# EAGLE design MHI-AC-Ctrl_v1.2 (EAGLE 9.6.2)
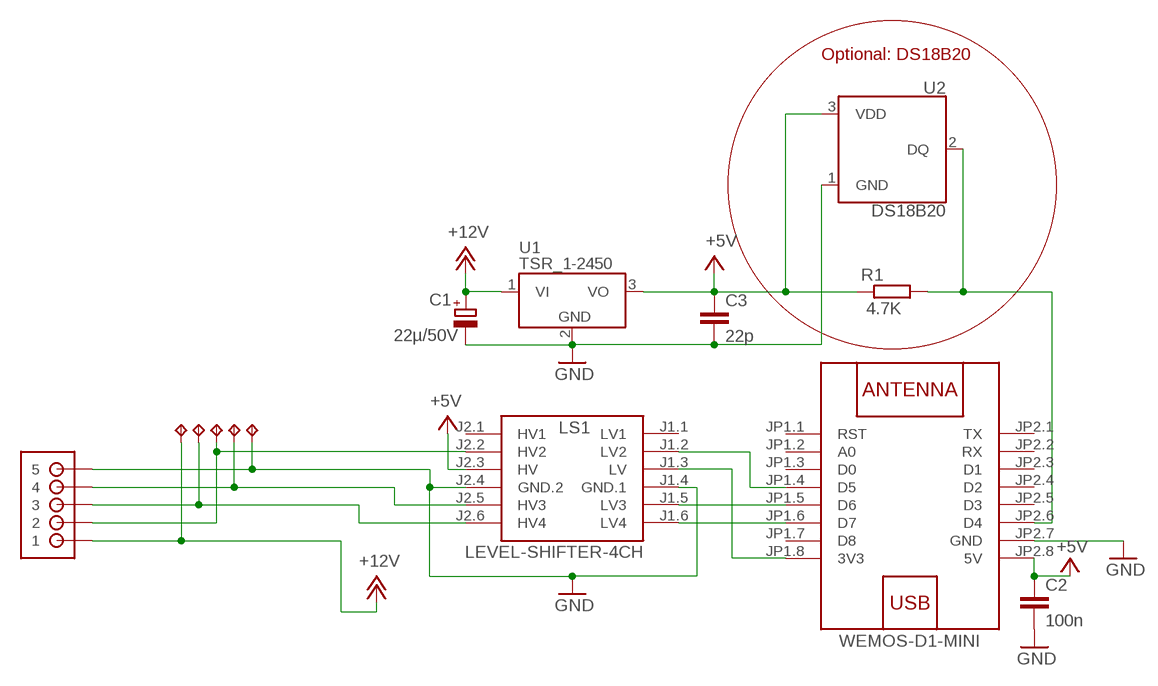
[diagram p0: schematic, sheet 1]

## Parts
C1  22µ/50V  CPOL-EUE5-10.5  [E5-10,5]
C2  100n  C-EU025-024X044  [C025-024X044]
C3  22p  C-EU025-024X044  [C025-024X044]
LS1  LEVEL-SHIFTER-4CH  [LEVEL-SHIFTER-4CH]
R1  4.7K  R-EU_0204/7  [0204/7]
TP9  TPPAD1-13  [P1-13]
TP10  TPPAD1-13  [P1-13]
TP11  TPPAD1-13  [P1-13]
TP12  TPPAD1-13  [P1-13]
TP13  TPPAD1-13  [P1-13]
U1  TSR_1-2450  TSR_1-24_  [TSR-1]
U2  DS18B20  [TO-92-TO92127P495H2044-3]
U$1  WEMOS-D1-MINI  [WEMOS-D1-MINI]
U$4  JST-PH_5-PIN_HEADER  [JST_B5B-PH_HEADER]

## Nets
+3V3: LS1.J1.3(LV) U$1.JP1.8(3V3)
+5V: C2.1 C3.1 LS1.J2.3(HV) R1.2 U1.3(VO) U2.3(VDD) U$1.JP2.8(5V)
+12V: C1.+ TP13.TP U1.1(VI) U$4.P1
GND: C1.- C2.2 C3.2 LS1.J1.4(GND.1) LS1.J2.4(GND.2) TP9.TP U1.2(GND) U2.1(GND) U$1.JP2.7(GND) U$4.P5
MISO: LS1.J2.5(HV3) TP10.TP U$4.P4
N$1: LS1.J1.5(LV3) U$1.JP1.5(D6)
N$2: LS1.J1.6(LV4) U$1.JP1.6(D7)
N$3: LS1.J2.2(HV2) TP11.TP U$4.P2
N$4: LS1.J2.6(HV4) TP12.TP U$4.P3
N$14: R1.1 U2.2(DQ) U$1.JP2.6(D4)
SCL_LV: LS1.J1.2(LV2) U$1.JP1.4(D5)
Unconnected: LS1.J1.1(LV1) LS1.J2.1(HV1) U$1.JP1.1(RST) U$1.JP1.2(A0) U$1.JP1.3(D0) U$1.JP1.7(D8) U$1.JP2.1(TX) U$1.JP2.2(RX) U$1.JP2.3(D1) U$1.JP2.4(D2) U$1.JP2.5(D3)

## Notes on the sheet
- Optional: DS18B20

## Library data of the parts
C1 = rcl:CPOL-EU: POLARIZED CAPACITOR, European symbol; SPICEPREFIX: C
C2 C3 = rcl:C-EU: CAPACITOR, European symbol; SPICEPREFIX: C
LS1 = diy-modules:LEVEL-SHIFTER-4CH: 4-Channel Bi-Directional Logic Level Converter based on BSS128 transistors Click here to find device on ebay.com <http://www.ebay.com/sch/i2c+logic+converter+module>
R1 = rcl:R-EU_: RESISTOR, European symbol; SPICEPREFIX: R
TP9-TP13 = testpad:TP: Test pad
U1 = _traco_tsr-1:TSR_1-*: TRACO TSR-1 Series Point-of-Load DC/DC-Converters Vi max. 36 V; Vo = (1.2 .. 15)V ±2%; Io = 0 .. 1 A SIP-Package (drop-in replacement for 78xx linear voltage regulators in TO220-package, vertically assembled) Source: www.tracopower.com Technologies: TSR 1- Vi (V) Vo (V) ±2% Io = 0 .. 1 A 24_ ( generic ) 2412 4.6 .. 36 1.2 2415 4.6 .. 36 1.5 2418 4.6 .. 36 1.8 2425 4.6 .. 36 2.5 2433 4.75.. 36 3.3 2450 6.5 .. 36 5.0 2465 9.0 .. 36 6.5 2490 12 .. 36 9.0 24120 15 .. 36 12 24150 18 .. 36 15 Author: Dipl.-Ing. FH Rainer Bayer HHN Hochschule Heilbronn, rainer.bayer@hs-heilbronn.de Ingenieurbüro ing-rb, mail@ing-rb.de
U2 = DS18B20:DS18B20: digital thermometer -55C-125C TO92-3 Check prices <https://snapeda.com/parts/DS18B20/Maxim%20Integrated/view-part/?ref=eda>; AVAILABILITY: Bad; DESCRIPTION: Temperature Sensor Digital, Local -55°C ~ 125°C 12 b 8-uMAX; MF: Maxim Integrated; MP: DS18B20; PACKAGE: TO-92 Maxim Integrated; PRICE: None
U$1 = diy-modules:WEMOS-D1-MINI: WEMOS D1 mini: Mini Wi-Fi Board based on ESP-8266 device More details can be found here: https://www.wemos.cc/product/d1-mini.html Click here to find device on ebay.com <http://www.ebay.com/sch/wemos+d1+mini+nodemcu>
U$4 = srg:JST-PH_5-PIN_HEADER: 5-pin JST PH Shrouded Header, top entry P/N B5B-PH-K-S Mating connector PHR-5 Mating cable assembly: Sparkfun PRT-09917 <http://www.sparkfun.com/products/9917>

## Board
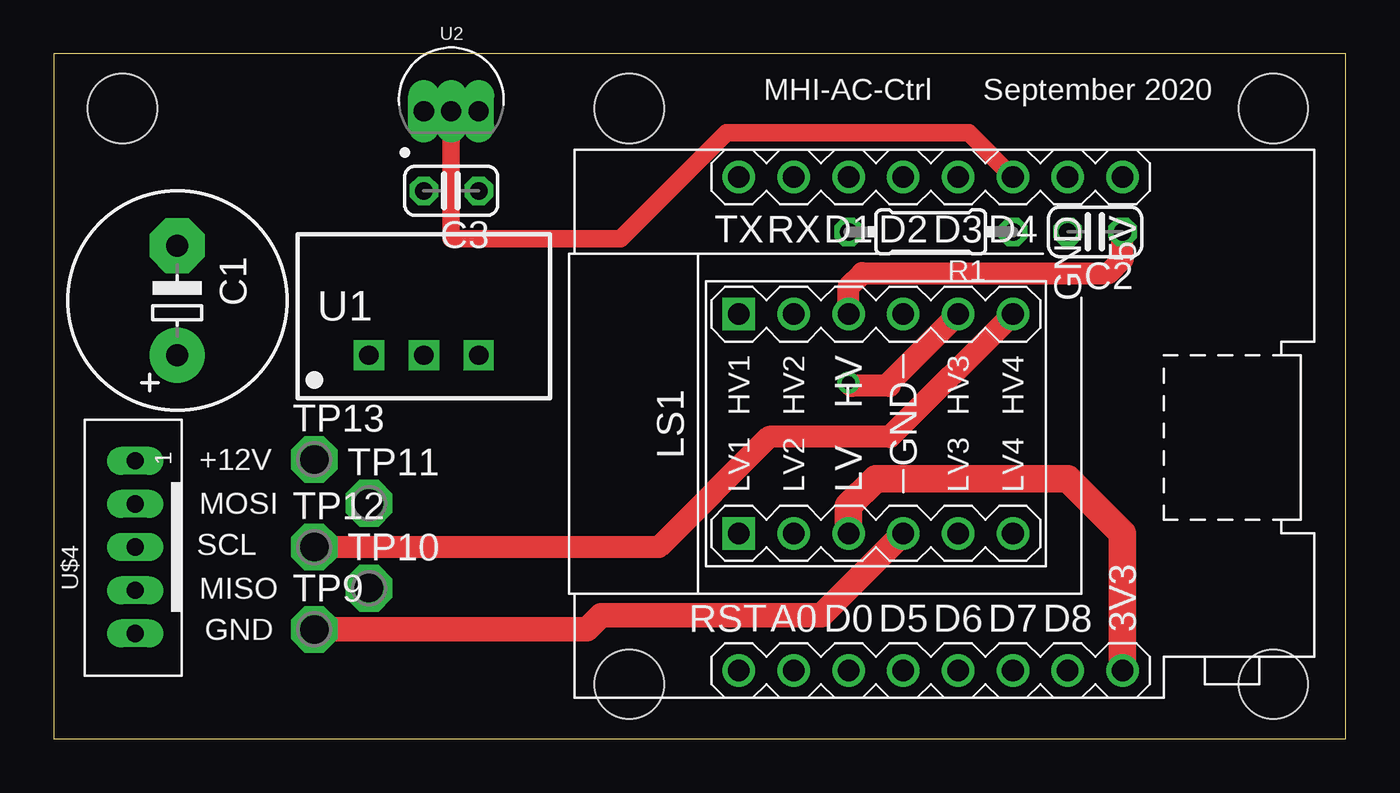
[diagram p1: board, top side]
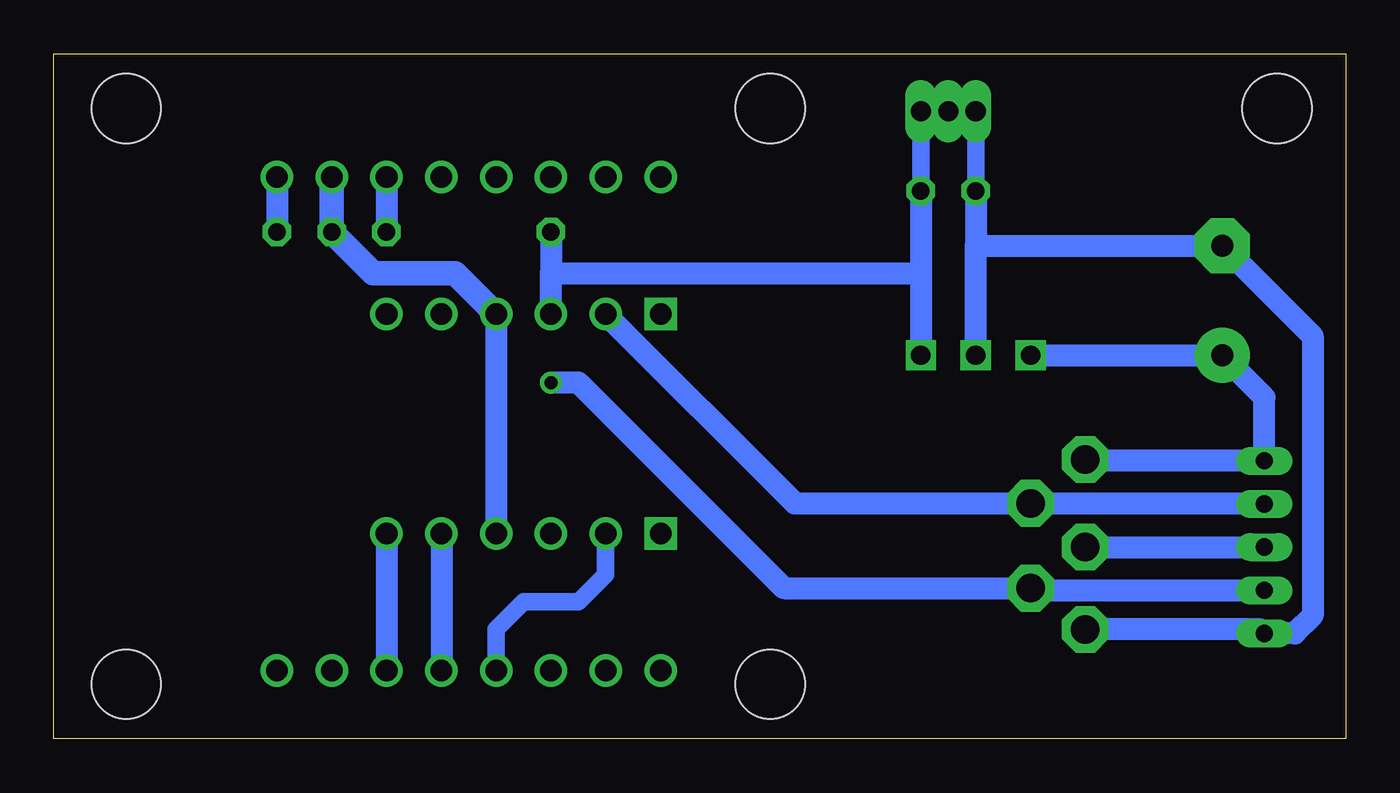
[diagram p2: board, bottom side, seen from below]

Size 59.87 x 31.74 mm. Coordinates in mm from the lower left corner, seen from the top.
Outline: 0,0 59.87,0 59.87,31.74 0,31.74 0,0
Copper layers (1*16): Top 0.035mm / dielectric 1.5mm / Bottom 0.035mm
Design rules "default": minimum track width 6mil, minimum drill 0.35mm, track to track 6mil, track to pad 6mil, pad to pad 6mil, via to via 6mil, smd to smd 6mil, copper to edge 40mil, drill to drill 6mil, minimum pad ring 10mil, minimum via ring 8mil, stop-mask expansion 4mil, vias tented up to drill 0mil, thermal gap 10mil
Holes 3.2 mm at 56.52,2.54 26.67,2.54 3.17,29.21 56.52,29.21 26.67,29.21

### Footprints (pad centres in the part's own frame; a part is rotated, then mirrored left to right if it is on the bottom)
E5-10,5 = drill 1.016 pad 2.54: + -2.54,0 | drill 1.016 pad 2.54 octagon: - 2.54,0
C025-024X044 = drill 0.813 octagon: 1 -1.27,0; 2 1.27,0
LEVEL-SHIFTER-4CH = drill 1 square: J1.1 -5.08,6.35; J2.1 5.08,6.35 | drill 1: J1.2 -5.08,3.81; J1.3 -5.08,1.27; J1.4 -5.08,-1.27; J1.5 -5.08,-3.81; J1.6 -5.08,-6.35; J2.2 5.08,3.81; J2.3 5.08,1.27; J2.4 5.08,-1.27; J2.5 5.08,-3.81; J2.6 5.08,-6.35
0204/7 = drill 0.813 octagon: 1 -3.81,0; 2 3.81,0
P1-13 = drill 1.321 pad 2.159 octagon: TP 0,0
TSR-1 = drill 0.9 square: 1 -2.54,0; 2 0,0; 3 2.54,0
TO-92-TO92127P495H2044-3 = drill 0.93 pad 1.11 long: 1 -1.27,-0.76; 2 0,-0.76; 3 1.27,-0.76
WEMOS-D1-MINI = drill 1: JP1.1 -11.43,9.525; JP1.2 -11.43,6.985; JP1.3 -11.43,4.445; JP1.4 -11.43,1.905; JP1.5 -11.43,-0.635; JP1.6 -11.43,-3.175; JP1.7 -11.43,-5.715; JP1.8 -11.43,-8.255; JP2.1 11.43,9.525; JP2.2 11.43,6.985; JP2.3 11.43,4.445; JP2.4 11.43,1.905; JP2.5 11.43,-0.635; JP2.6 11.43,-3.175; JP2.7 11.43,-5.715; JP2.8 11.43,-8.255
JST_B5B-PH_HEADER = drill 0.8 long: P1 4,0.048; P2 2,0.048; P3 0,0.048; P4 -2,0.048; P5 -4,0.048

### Placement (x,y rotation side)
C1  5.71,20.32 90 top
C2  48.26,23.5 180 top
C3  18.41,25.4 180 top
LS1  38.1,14.61 90 top
R1  40.64,23.5 180 top
TP9  12.06,5.08 0 top
TP10  14.61,6.99 0 top
TP11  14.61,10.92 0 top
TP12  12.06,8.89 0 top
TP13  12.06,12.95 0 top
U1  17.14,17.78 0 top
U2  18.41,29.84 0 top
U$1  41.27,14.61 90 top
U$4  3.81,8.89 90 top

### Tracks (layer width: path | path; a pad name or v marks a point on that pad's centre or on a via)
+3V3
  Top 1.27: U$1.JP1.8 49.53,9.53 46.99,12.06 38.1,12.06 36.83,10.79 LS1.J1.3
+5V
  Top 1.016: LS1.J2.3 36.83,20.95 37.47,21.59 48.9,21.59 49.53,22.23 C2.1
  Bottom 0.813: U2.3 C3.1
  Bottom 1.016: U$1.JP2.8 C2.1 | LS1.J2.3 36.83,21.59 | 19.68,21.59 C3.1 19.79,25.4 | 19.68,21.59 U1.3 | 36.83,21.59 19.68,21.59 | R1.2 36.83,21.59
+12V
  Bottom 1.016: U1.1 C1.+ 3.76,15.83 U$4.P1 11.88,12.89 TP13.TP
GND
  Top 1.016: 12.26,4.89 TP9.TP
  Top 1.143: TP9.TP 24.7,5.08 25.35,5.73 35.57,5.73 LS1.J1.4
  Bottom 0.813: U2.1 C3.2
  Bottom 1.016: 17.14,22.86 U1.2 17.04,17.67 | 12.06,4.89 TP9.TP | 11.88,4.89 TP9.TP | 17.14,22.86 C1.- 1.52,18.67 1.52,5.71 2.35,4.89 U$4.P5 3.95,5.08 TP9.TP | C3.2 17.14,22.86 | LS1.J2.4 LS1.J1.4
  Bottom 1.143: U$1.JP2.7 C2.2 45.09,21.59 41.27,21.59 LS1.J2.4
MISO  (via drill 0.6)
  Top 1.016: 14.51,6.89 TP10.TP | v36.83,16.51 36.97,16.37 38.73,16.37 38.73,16.51 LS1.J2.5
  Bottom 1.016: v36.83,16.51 35.56,16.51 26.04,6.99 TP10.TP 14.51,6.89 U$4.P4
N$1
  Bottom 1.016: LS1.J1.5 U$1.JP1.5
N$2
  Bottom 1.016: LS1.J1.6 U$1.JP1.6
N$3
  Bottom 1.016: LS1.J2.2 25.53,10.92 TP11.TP 14.57,10.89 U$4.P2
N$4
  Top 1.016: LS1.J2.6 38.76,13.99 33.14,13.99 28.04,8.89 TP12.TP
  Bottom 1.016: TP12.TP U$4.P3
N$14
  Top 0.813: U2.2 18.41,23.18 26.26,23.18 31.16,28.08 42.4,28.08 U$1.JP2.6
  Bottom 1.016: U$1.JP2.6 R1.1
SCL_LV
  Bottom 0.813: LS1.J1.2 34.29,7.62 35.56,6.35 38.1,6.35 39.37,5.08 U$1.JP1.4

### Text on the board
tPlace: MHI-AC-Ctrl | September 2020 | +12V | MOSI | SCL | MISO | GND